# EAGLE design LPC_AP2_3.52 (EAGLE 6.3)
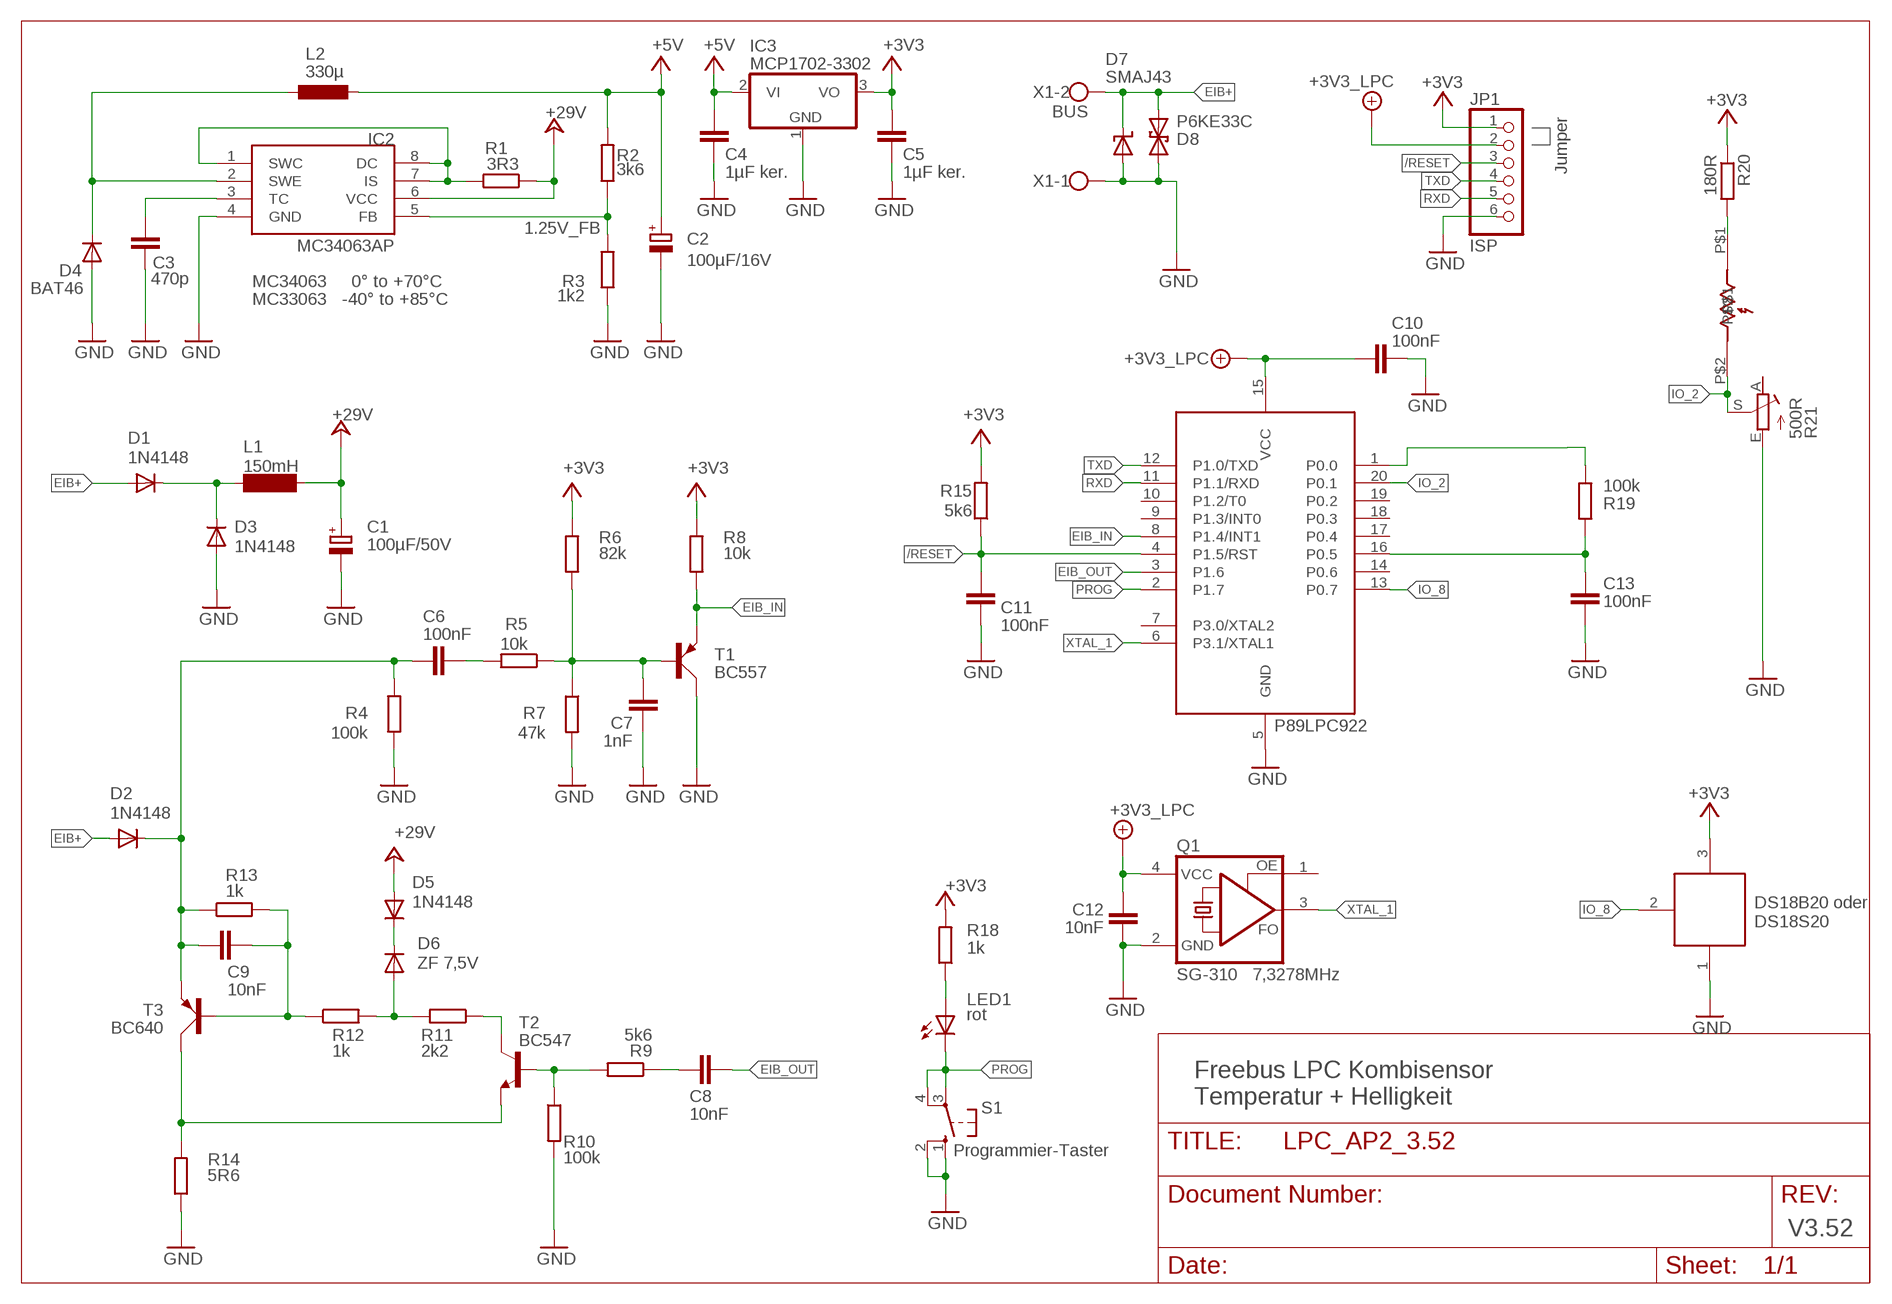
[diagram p0: schematic, sheet 1]

## Parts
C1  100µF/50V  CPOL-EUE3.5-8  [E3,5-8]
C2  100µF/16V  CPOL-EUE2-5  [E2-5]
C3  470p  C-EU025-024X044  [C025-024X044]
C4  1µF ker.  C-EU050-024X044  [C050-024X044]
C5  1µF ker.  C-EU050-024X044  [C050-024X044]
C6  100nF  C-EU050-024X044  [C050-024X044]
C7  1nF  C-EU050-024X044  [C050-024X044]
C8  10nF  C-EU050-024X044  [C050-024X044]
C9  10nF  C-EU050-024X044  [C050-024X044]
C10  100nF  C-EUC0805K  [C0805K]
C11  100nF  C-EU050-024X044  [C050-024X044]
C12  10nF  C-EUC0805K  [C0805K]
C13  100nF  C-EU050-024X044  [C050-024X044]
D1  1N4148  DIODE-D-2.5  [D-2.5]
D2  1N4148  1N4148DO35-7  [DO35-7]
D3  1N4148  DIODE-D-2.5  [D-2.5]
D4  BAT46  1N4148DO34-5R  [DO34-5R]
D5  1N4148  1N4148DO34-5R  [DO34-5R]
D6  ZF 7,5V  1N4148DO34-5R  [DO34-5R]
D7  SMAJ43  SUPPRESSOR-SMBJ  [SMBJ]
D8  P6KE33C  P6KEXXCDO41-7  [DO41-7]
IC1  89LPC922FN  89LPC922  [DIL20]
IC2  MC34063AP  [DIL08]
IC3  MCP1702-3302  MCP1703TO92  [TO92]
IC4  DS18X20  DS18X  [DS18X]
JP1  ISP  PINHD-1X6  [1X06]
L1  150mH  SD12K100  [SD12K100]
L2  330µ  L-EU0207/7  [0207/7]
LDR1  LDR07  [LDR07]
LED1  rot  LED3MM  [LED3MM]
Q1  SG-310 7,3278MHz  ASF1  [ASF]
R1  3R3  R-EU_0207/2V  [0207/2V]
R2  3k6  R-EU_0207/2V  [0207/2V]
R3  1k2  R-EU_0207/2V  [0207/2V]
R4  100k  R-EU_0207/2V  [0207/2V]
R5  10k  R-EU_0207/2V  [0207/2V]
R6  82k  R-EU_0207/2V  [0207/2V]
R7  47k  R-EU_0207/2V  [0207/2V]
R8  10k  R-EU_0207/2V  [0207/2V]
R9  5k6  R-EU_0207/2V  [0207/2V]
R10  100k  R-EU_0207/2V  [0207/2V]
R11  2k2  R-EU_0207/2V  [0207/2V]
R12  1k  R-EU_0207/2V  [0207/2V]
R13  1k  R-EU_0207/7  [0207/7]
R14  5R6  R-EU_0207/2V  [0207/2V]
R15  5k6  R-EU_0207/2V  [0207/2V]
R18  1k  R-EU_0207/7  [0207/7]
R19  100k  R-EU_0207/7  [0207/7]
R20  180R  R-EU_0207/2V  [0207/2V]
R21  500R  R-TRIMM-PT6L  [PT6L]
S1  Programmier-Taster  10-XX  [B3F-10XX]
T1  BC557  [SOT54A]
T2  BC547  [TO92]
T3  BC640  [SOT54D]
X1  BUS  W237-02P  [W237-132]

## Nets
1.25V_FB: IC2.5(FB) R2.1 R3.2
+3V3: C5.1 IC3.3(VO) IC4.3(VDD) JP1.1 R6.2 R8.2 R15.2 R18.2 R20.1
+4.1V: C10.2 C12.1 IC1.15(VCC) JP1.2 Q1.4(VCC) ; supply symbol labelled +3V3_LPC
+5V: C2.+ C4.1 IC3.2(VI) L2.1 R2.2
+24V: C1.+ D5.A IC2.6(VCC) L1.2 R1.1 ; supply symbol labelled +29V
/RESET: C11.2 IC1.4(P1.5/RST) JP1.3 R15.1
EIB+: D1.A D2.A D7.C D8.C X1.2
EIB_IN: IC1.8(P1.4/INT1) R8.1 T1.E
EIB_IN_OUT: C6.1 C9.1 D2.C R4.2 R13.1 T3.E
EIB_OUT: C8.2 IC1.3(P1.6)
GND: C1.- C2.- C3.1 C4.2 C5.2 C7.1 C10.1 C11.1 C12.2 C13.1 D3.A D4.A D7.A D8.A IC1.5(GND) IC2.4(GND) IC3.1(GND) IC4.1(GND) JP1.6 Q1.2(GND) R3.1 R4.1 R7.2 R10.2 R14.1 R21.E S1.1(S) S1.2(S1) T1.C X1.1
IO_1: IC1.1(P0.0) R19.1
IO_2: IC1.20(P0.1) LDR1.P$2 R21.S
IO_6: C13.2 IC1.16(P0.5) R19.2
IO_8: IC1.13(P0.7) IC4.2(IO)
N$1: C8.1 R9.1
N$2: C6.2 R5.2
N$3: D6.A R11.2 R12.2
N$4: IC2.1(SWC) IC2.7(IS) IC2.8(DC) R1.2
N$5: R11.1 T2.3(C)
N$6: LDR1.P$1 R20.2
N$7: R14.2 T2.1(E) T3.C
N$8: D1.C D3.C L1.1
N$9: D5.C D6.C
N$10: D4.C IC2.2(SWE) L2.2
N$12: R9.2 R10.1 T2.2(B)
N$13: C3.2 IC2.3(TC)
N$14: C7.2 R5.1 R6.1 R7.1 T1.B
N$15: C9.2 R12.1 R13.2 T3.B
N$41: LED1.A R18.1
PROG: IC1.2(P1.7) LED1.K(C) S1.3(P) S1.4(P1)
RXD: IC1.11(P1.1/RXD) JP1.5
TXD: IC1.12(P1.0/TXD) JP1.4
XTAL_1: IC1.6(P3.1/XTAL1) Q1.3(FO)
Unconnected: IC1.7(P3.0/XTAL2) IC1.9(P1.3/INT0) IC1.10(P1.2/T0) IC1.14(P0.6) IC1.17(P0.4) IC1.18(P0.3) IC1.19(P0.2) Q1.1(OE) R21.A

## Notes on the sheet
- Jumper
- MC34063     0° to +70°C
- MC33063   -40° to +85°C
- P89LPC922
- DS18B20 oder
  DS18S20
- Freebus LPC Kombisensor
  Temperatur + Helligkeit
- V3.52

## Library data of the parts
C1 C2 = rcl:CPOL-EU: POLARIZED CAPACITOR, European symbol
C3-C13 = rcl:C-EU: CAPACITOR, European symbol
D1 D3 = diode:DIODE-: DIODE
D2 D4-D6 = diode:1N4148: DIODE high speed (Philips)
D7 = diode:SUPPRESSOR-: Suppressor diode
D8 = diode:P6KEXXC: DIODE transient-voltage suppressor
IC1 = micro-philips:89LPC922
IC2 = mc34063:MC34063
IC3 = linear:MCP1703: 250 mA, 16V, Low Quiescent Current LDO Regulator Source: http://ww1.microchip.com/downloads/en/DeviceDoc/22049b.pdf
IC4 = Uwe:DS18X
JP1 = pinhead:PINHD-1X6: PIN HEADER
L1 = inductor-neosid:SD12: INDUCTOR nominal inductance; OC_FARNELL: unknown; OC_NEWARK: unknown
L2 = rcl:L-EU: INDUCTOR, European symbol
LDR1 = ldr:LDR07
LED1 = Uwe:LED: LED OSRAM: - CHIPLED LG R971, LG N971, LY N971, LG Q971, LY Q971, LO R971, LY R971 LH N974, LH R974 LS Q976, LO Q976, LY Q976 LO Q996 - Hyper CHIPLED LW Q18S LB Q993, LB Q99A, LB R99A - SideLED LS A670, LO A670, LY A670, LG A670, LP A670 LB A673, LV A673, LT A673, LW A673 LH A674 LY A675 LS A676, LA A676, LO A676, LY A676, LW A676 LS A679, LY A679, LG A679 - Hyper Micro SIDELED® LS Y876, LA Y876, LO Y876, LY Y876 LT Y87S - SmartLED LW L88C, LW L88S LB L89C, LB L89S, LG L890 LS L89K, LO L89K, LY L89K LS L896, LA L896, LO L896, LY L896 - TOPLED LS T670, LO T670, LY T670, LG T670, LP T670 LSG T670, LSP T670, LSY T670, LOP T670, LYG T670 LG T671, LOG T671, LSG T671 LB T673, LV T673, LT T673, LW T673 LH T674 LS T676, LA T676, LO T676, LY T676, LB T676, LH T676, LSB T676, LW T676 LB T67C, LV T67C, LT T67C, LS T67K, LO T67K, LY T67K, LW E67C LS E67B, LA E67B, LO E67B, LY E67B, LB E67C, LV E67C, LT E67C LW T67C LS T679, LY T679, LG T679 LS T770, LO T770, LY T770, LG T770, LP T770 LB T773, LV T773, LT T773, LW T773 LH T774 LS E675, LA E675, LY E675, LS T675 LS T776, LA T776, LO T776, LY T776, LB T776 LHGB T686 LT T68C, LB T68C - Hyper Mini TOPLED® LB M676 - Mini TOPLED Santana® LG M470 LS M47K, LO M47K, LY M47K Source: http://www.osram.convergy.de LUXEON: - LUMILED® LXK2-PW12-R00, LXK2-PW12-S00, LXK2-PW14-U00, LXK2-PW14-V00 LXK2-PM12-R00, LXK2-PM12-S00, LXK2-PM14-U00 LXK2-PE12-Q00, LXK2-PE12-R00, LXK2-PE12-S00, LXK2-PE14-T00, LXK2-PE14-U00 LXK2-PB12-K00, LXK2-PB12-L00, LXK2-PB12-M00, LXK2-PB14-N00, LXK2-PB14-P00, LXK2-PB14-Q00 LXK2-PR12-L00, LXK2-PR12-M00, LXK2-PR14-Q00, LXK2-PR14-R00 LXK2-PD12-Q00, LXK2-PD12-R00, LXK2-PD12-S00 LXK2-PH12-R00, LXK2-PH12-S00 LXK2-PL12-P00, LXK2-PL12-Q00, LXK2-PL12-R00 Source: www.luxeon.com KINGBRIGHT: KA-3528ASYC Source: www.kingbright.com
Q1 = crystal:ASF*: CRYSTAL CLOCK OSCILLATORS 5.0 Vdc or 3.3 Vdc - LOW PROFILE ULTRA MINIATURE CERAMIC SURFACE MOUNT Source: http://www.abracon.com/Oscillators/asf1-L-L1.pdf; OC_FARNELL: unknown; OC_NEWARK: unknown
R1-R15 R18-R20 = rcl:R-EU_: RESISTOR, European symbol
R21 = kubi:R-TRIMM
S1 = switch-omron:10-XX: OMRON SWITCH; MPN: B3F-1000; OC_FARNELL: 176432; OC_NEWARK: 36M3542
T1 = transistor-small-signal:BC557: PNP TRANSISTOR
T2 = transistor:BC547: NPN TRANSISTOR
T3 = transistor-small-signal:BC640: PNP TRANSISTOR
X1 = con-wago-508:W237-02P: WAGO SREW CLAMP

## Board
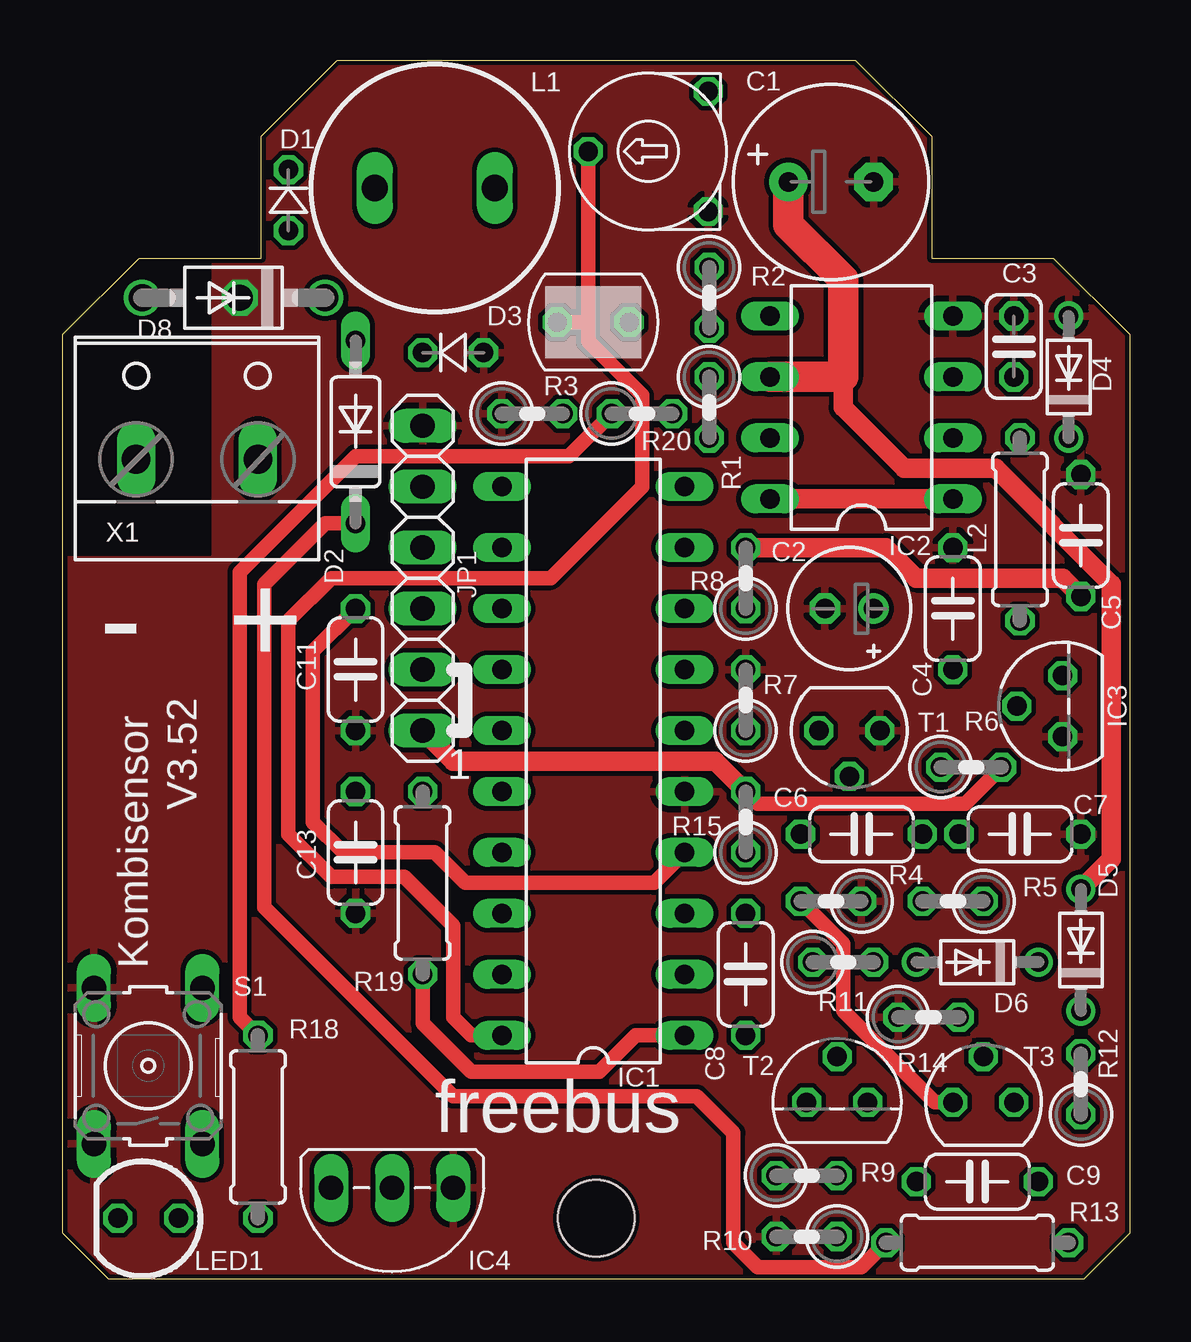
[diagram p1: board, top side]
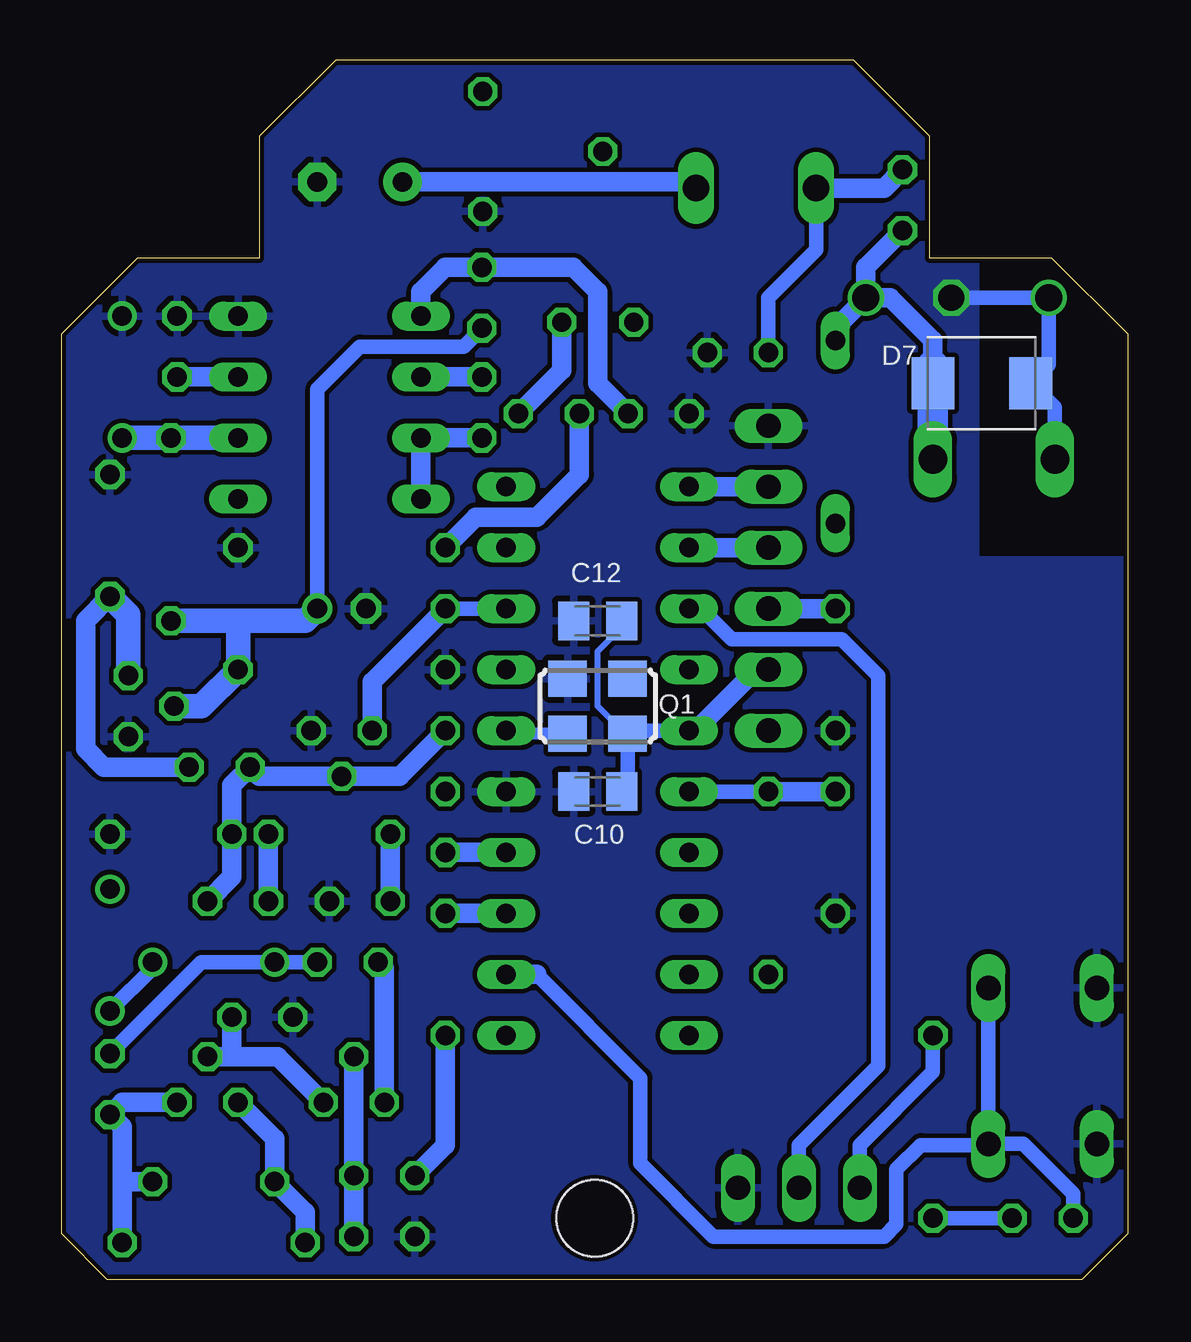
[diagram p2: board, bottom side, seen from below]

Size 44.45 x 50.8 mm. Coordinates in mm from the lower left corner, seen from the top.
Outline: 1.91,0 0,1.91 0,39.37 3.17,42.55 8.26,42.55 8.26,47.62 11.43,50.8 33.02,50.8 36.2,47.62 36.2,42.55 41.27,42.55 44.45,39.37 44.45,1.91 42.55,0 1.91,0
Copper layers (1*16): Top 0.035mm / dielectric 1.5mm / Bottom 0.035mm
Design rules "HAKA Zwillingsangebot": minimum track width 0.2mm, minimum drill 0.5mm, track to track 0.2mm, track to pad 0.2mm, pad to pad 0.15mm, via to via 0.2mm, smd to smd 0mil, copper to edge 0.2mm, drill to drill 0.2mm, minimum pad ring 0.2mm, minimum via ring 0.2mm, stop-mask expansion 0.1mm, vias tented up to drill 0mil, thermal gap 10mil
Holes 3.2 mm at 22.23,2.54

### Footprints (pad centres in the part's own frame; a part is rotated, then mirrored left to right if it is on the bottom)
E3,5-8 = drill 0.813 pad 1.6: + -1.778,0 | drill 0.813 pad 1.6 octagon: - 1.778,0
E2-5 = drill 0.813 pad 1.27: + -1.016,0 | drill 0.813 pad 1.27 octagon: - 1.016,0
C025-024X044 = drill 0.813 octagon: 1 -1.27,0; 2 1.27,0
C050-024X044 = drill 0.813 octagon: 1 -2.54,0; 2 2.54,0
C0805K = smd 1.3 x 1.6: 1 -1,0; 2 1,0
D-2.5 = drill 0.813 octagon: A 1.27,0; C -1.27,0
DO35-7 = drill 0.813 long: A 3.81,0; C -3.81,0
DO34-5R = drill 0.813: A 2.54,0; C -2.54,0
SMBJ = smd 1.78 x 2.16: A 2.04,0; C -2.03,0
DO41-7 = drill 1.118: A 3.81,0; C -3.81,0
DIL20 = drill 0.813 long: 1 -11.43,-3.81; 2 -8.89,-3.81; 3 -6.35,-3.81; 4 -3.81,-3.81; 5 -1.27,-3.81; 6 1.27,-3.81; 7 3.81,-3.81; 8 6.35,-3.81; 9 8.89,-3.81; 10 11.43,-3.81; 11 11.43,3.81; 12 8.89,3.81; 13 6.35,3.81; 14 3.81,3.81; 15 1.27,3.81; 16 -1.27,3.81; 17 -3.81,3.81; 18 -6.35,3.81; 19 -8.89,3.81; 20 -11.43,3.81
DIL08 = drill 0.813 long: 1 -3.81,-3.81; 2 -1.27,-3.81; 3 1.27,-3.81; 4 3.81,-3.81; 5 3.81,3.81; 6 1.27,3.81; 7 -1.27,3.81; 8 -3.81,3.81
TO92 = drill 0.813 octagon: 1 -1.27,0; 2 0,1.905; 3 1.27,0
DS18X = drill 1.016 long: 1 -2.54,0; 2 0,0; 3 2.54,0
1X06 = drill 1.016 long: 1 -6.35,0; 2 -3.81,0; 3 -1.27,0; 4 1.27,0; 5 3.81,0; 6 6.35,0
SD12K100 = drill 1.1 long: 1 -2.5,0; 2 2.5,0
0207/7 = drill 0.813 octagon: 1 -3.81,0; 2 3.81,0
LDR07 = drill 0.8 octagon: P$1 -1.5,0; P$2 1.5,0
LED3MM = drill 0.813 octagon: A -1.27,0; K 1.27,0
ASF = smd 1.6 x 1.5: 1 -1.25,-1.15; 2 1.25,-1.15; 3 1.25,1.15; 4 -1.25,1.15
0207/2V = drill 0.813 octagon: 1 -1.27,0; 2 1.27,0
PT6L = drill 0.8 octagon: A 2.5,2.5; E 2.5,-2.5; S -2.5,0
B3F-10XX = drill 1.016 long: 1 -3.251,2.261; 2 3.251,2.261; 3 -3.251,-2.261; 4 3.251,-2.261
SOT54A = drill 0.813 octagon: B 0,1.905; C -1.27,0; E 1.27,0
TO92' = drill 0.813 octagon: 1 1.27,0; 2 0,1.905; 3 -1.27,0
SOT54D = drill 0.813 octagon: B 1.27,0; C 0,1.905; E -1.27,0
W237-132 = drill 1.194 long: 1 -2.54,-0.635; 2 2.54,-0.635

### Placement (x,y rotation side)
C1  32,45.72 0 top
C2  32.77,27.94 180 top
C3  39.62,38.86 270 top
C4  37.08,27.94 90 top
C5  42.42,30.99 90 top
C6  33.27,18.54 0 top
C7  39.88,18.54 180 top
C8  28.45,12.7 90 top
C9  38.1,4.06 0 top
C10  22.1,20.32 0 bottom
C11  12.19,25.4 90 top
C12  22.1,27.43 180 bottom
C13  12.19,17.78 90 top
D1  9.4,44.96 270 top
D2  12.19,35.31 90 top
D3  16.26,38.61 0 top
D4  41.91,37.59 90 top
D5  42.42,13.72 90 top
D6  38.1,13.21 180 top
D7  6.1,37.34 0 bottom
D8  7.11,40.89 180 top
IC1  22.1,21.59 90 top
IC2  33.27,36.32 90 top
IC3  41.66,23.88 90 top
IC4  13.72,3.81 180 top
JP1  14.99,29.21 90 top
L1  15.49,45.47 0 top
L2  39.88,31.24 90 top
LDR1  22.1,39.88 180 top
LED1  3.56,2.54 180 top
Q1  22.1,23.88 180 bottom
R1  26.92,36.32 270 top
R2  26.92,40.89 270 top
R3  19.56,36.07 0 top
R4  32,15.75 180 top
R5  37.08,15.75 180 top
R6  37.85,21.34 0 top
R7  28.45,24.13 90 top
R8  28.45,29.21 90 top
R9  30.99,4.32 0 top
R10  30.99,1.78 180 top
R11  32.51,13.21 0 top
R12  42.42,8.13 90 top
R13  38.1,1.52 0 top
R14  36.07,10.92 0 top
R15  28.45,19.05 90 top
R18  8.13,6.35 90 top
R19  14.99,16.51 90 top
R20  24.13,36.07 0 top
R21  24.38,46.99 0 top
S1  3.56,8.89 90 top
T1  32.77,22.86 180 top
T2  BC547  [TO92']  32.26,7.37 0 top
T3  38.35,7.37 0 top
X1  5.59,34.8 0 top

### Tracks (layer width: path | path; a pad name or v marks a point on that pad's centre or on a via)
1.25V_FB
  Bottom 0.813: IC2.5 29.46,41.15 28.45,42.16 R2.1 23.11,42.16 22.1,41.15 22.1,37.34 R3.2
+3V3
  Top 0.61: R6.2 37.59,19.81 28.96,19.81 R15.2 | R18.2 7.37,10.92 7.37,29.46 12.19,34.29 21.08,34.29 R20.1
  Top 0.813: R8.2 34.29,30.48 35.56,29.21 41.66,29.21 C5.1 | JP1.1 16.26,21.59 27.18,21.59 R15.2
  Bottom 0.61: R18.2 8.13,8.64 11.18,5.59 IC4.3
  Bottom 0.813: R6.2 42.67,21.34 43.43,22.1 43.43,27.43 C5.1 | R8.2 27.18,31.75 24.64,31.75 22.86,33.53 R20.1
  Bottom 1.016: IC3.3 41.66,27.69 C5.1
+4.1V
  Bottom 0.254: 20.95,22.73 22.1,23.88 22.1,26.16 21.34,26.92 | 21.34,27.19 C12.1
  Bottom 0.508: Q1.4 20.95,22.73 | 21.34,26.92 21.34,27.19
  Bottom 0.61: C10.2 20.85,20.57 Q1.4 20.71,22.86 IC1.15 18.03,22.86
  Bottom 0.813: 18.03,22.86 15.49,25.4 JP1.2
+5V
  Bottom 0.61: C2.+ 33.78,37.08 32,38.86 27.69,38.86 R2.2
  Bottom 0.813: 37.08,27.18 37.34,27.43
  Bottom 1.016: IC3.2 38.61,23.88 C4.1 37.08,27.18 | L2.1 37.34,27.43 34.29,27.43 C2.+
+24V
  Top 0.813: D5.A 43.69,17.53 43.69,28.96 38.86,33.78 35.05,33.78 32.51,36.32 32.51,37.59
  Top 1.27: C1.+ 30.23,43.94 32.51,41.66 32.51,37.59 IC2.6
  Bottom 0.813: C1.+ 18.25,45.72 L1.2 | IC2.6 R1.1
/RESET
  Top 0.61: IC1.4 24.64,16.51 16.76,16.51 15.49,17.78 11.68,17.78 10.41,19.05 10.41,26.16 C11.2
  Bottom 0.813: C11.2 JP1.3 | IC1.4 R15.1
EIB+
  Bottom 0.813: D1.A 10.92,42.16 D8.C | D2.A 12.19,39.62 D8.C | 8.13,38.1 8.13,39.11 9.91,40.89 D8.C
  Bottom 1.27: X1.2 D7.C 8.13,38.1
EIB_IN
  Bottom 0.61: R8.1 IC1.8
  Bottom 0.813: T1.E 31.5,24.89 R8.1
EIB_IN_OUT
  Top 0.61: T3.E 36.32,7.37 32.51,11.18 32.51,13.97 R4.2 | R13.1 33.27,0.51 28.96,0.51 27.94,1.52 27.94,6.1 26.42,7.62 16.26,7.62 8.38,15.49 8.38,28.96 10.92,31.5 D2.C
  Bottom 0.813: C6.1 R4.2 | R13.1 34.29,2.79 C9.1 35.56,5.84 T3.E
EIB_OUT
  Bottom 0.813: IC1.3 C8.2
GND  (via drill 1.1)
  Bottom 0.61: X1.1 3.05,36.33 D7.A 3.3,38.09 D8.A v7.37,40.89
  pour Bottom: 1.78,0 42.67,0 44.45,1.78 44.45,39.37 41.15,42.67 36.07,42.67 36.07,47.75 33.02,50.8 11.43,50.8 8.13,47.5 8.13,42.67 6.35,42.67 6.35,29.97 0,29.97 0,1.78
  pour Top: 1.78,0 42.67,0 44.45,1.78 44.45,39.37 41.15,42.67 36.07,42.67 36.07,47.75 33.02,50.8 11.43,50.8 8.13,47.5 8.13,42.67 6.35,42.67 6.35,29.97 0,29.97 0,1.78
IO_1
  Top 0.61: R19.1 14.99,10.67 17.02,8.64 22.35,8.64 23.88,10.16 IC1.1
IO_2
  Top 0.61: 21.88,39.88 21.88,39.08 24.13,36.83 24.13,33.02 20.32,29.21 11.18,29.21 9.4,27.43 9.4,18.54 11.18,16.76 14.22,16.76 16.26,14.73 16.26,10.92 17.02,10.16 IC1.20 | 21.88,39.88 R21.S | LDR1.P$2 21.88,39.88
IO_6
  Bottom 0.61: R19.2 IC1.16
  Bottom 0.813: R19.2 C13.2
IO_8
  Bottom 0.61: IC1.13 17.78,27.94 16.51,26.67 11.94,26.67 10.41,25.15 10.41,8.89 13.72,5.59 IC4.2
N$1
  Bottom 0.813: C8.1 28.45,5.59 R9.1
N$2
  Bottom 0.813: C6.2 R5.2
N$3
  Bottom 0.61: R11.2 D6.A 38.61,13.21 R12.2
N$4
  Top 0.813: IC2.8 IC2.1
  Bottom 0.813: R1.2 IC2.7 IC2.8
N$5
  Bottom 0.61: 30.99,12.95 R11.1
  Bottom 0.813: T2.3 30.99,12.95
N$6
  Bottom 0.813: LDR1.P$1 23.6,37.87 R20.2
N$7
  Bottom 0.813: T2.1 35.43,9.27 37.34,9.27 | 37.34,9.27 T3.C | R14.2 37.34,9.27
N$8
  Bottom 0.61: L1.1 12.99,42.89 14.99,40.89 D3.C
  Bottom 0.813: L1.1 10.16,45.47 D1.C
N$9
  Bottom 0.61: D5.C 40.64,12.95 D6.C
N$10
  Bottom 1.016: IC2.2 L2.2 D4.C
N$12
  Bottom 0.813: R10.1 R9.2 T2.2
N$13
  Bottom 0.813: C3.2 IC2.3
N$14
  Bottom 0.813: R5.1 37.34,16.76 C7.2 37.34,20.57 R6.1 36.2,20.95 T1.B 30.35,20.95 R7.1
N$15
  Bottom 0.61: 41.66,4.06 41.91,3.81
  Bottom 0.813: R13.2 41.91,3.81 41.91,6.35 R12.1 41.91,7.37 T3.B | C9.2 41.66,4.06
N$41
  Bottom 0.61: LED1.A R18.1
PROG
  Bottom 0.61: 6.02,11.94 S1.4 S1.3 | LED1.K 2.29,3.56 4.37,5.64 S1.3 | 24.64,12.7 20.32,8.38 20.32,4.83 17.27,1.78 10.16,1.78 9.65,2.29 9.65,4.57 8.64,5.59 5.87,5.59 S1.3
  Bottom 0.813: IC1.2 24.64,12.7
RXD
  Bottom 0.813: JP1.5 IC1.11
TXD
  Bottom 0.813: IC1.12 JP1.4
XTAL_1
  Bottom 0.508: Q1.3 25.77,22.73 IC1.6

### Text on the board
tPlace: - | + | 1 | V3.52 | Kombisensor | freebus